# EAGLE schematic PCB-SSB-1x2b (EAGLE 6.4)
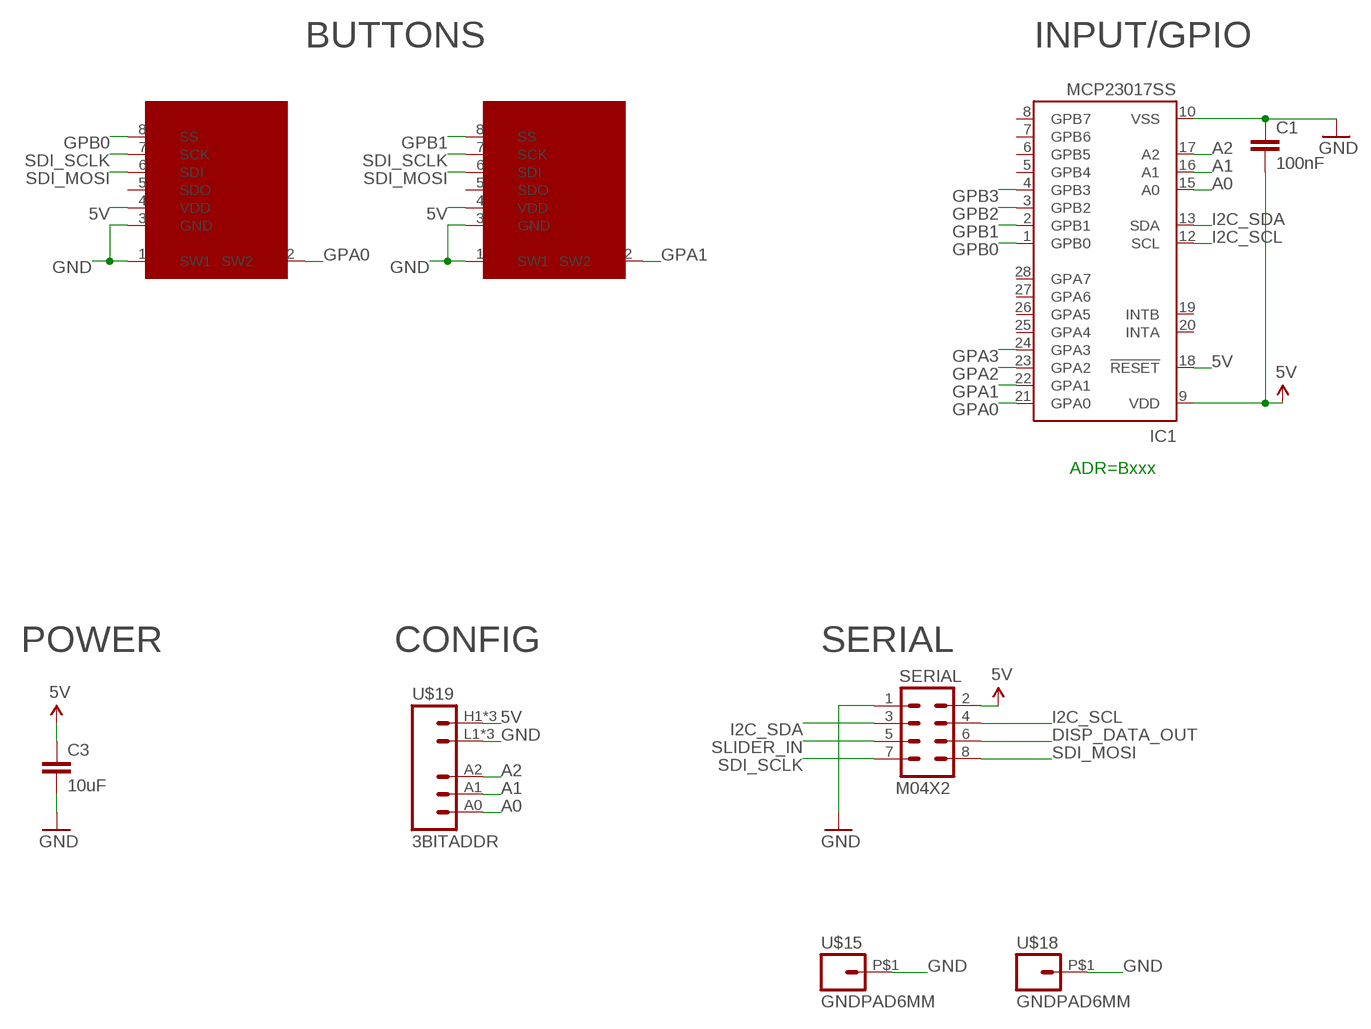
[diagram p0: schematic, sheet 1]

## Parts
C1  100nF  CAP0603-CAP  [0603-CAP]
C3  10uF  CAP0805  [0805]
IC1  MCP23017SS  [SSOP28]
SERIAL  M04X2  [2X4]
SSW1  SMART_SWITCHSMART_SWITCH_8PIN  [SMART_SWITCH]
SSW2  SMART_SWITCHSMART_SWITCH_8PIN  [SMART_SWITCH]
U$15  GNDPAD6MM  [3.2MMPAD6MM]
U$18  GNDPAD6MM  [3.2MMPAD6MM]
U$19  3BITADDR  [3BITADDR]

## Nets
5V [Power]: C1.2 C3.1 IC1.9(VDD) IC1.18(!RESET) SERIAL.2 SSW1.4(VDD) SSW2.4(VDD) U$19.H1(VCC) U$19.H2(VCC) U$19.H3(VCC)
A0: IC1.15(A0) U$19.A0
A1: IC1.16(A1) U$19.A1
A2: IC1.17(A2) U$19.A2
DISP_DATA_OUT: SERIAL.6
GND [Power]: C1.1 C3.2 IC1.10(VSS) SERIAL.1 SSW1.1(SW1) SSW1.3(GND) SSW2.1(SW1) SSW2.3(GND) U$15.P$1 U$18.P$1 U$19.L1(GND) U$19.L2(GND) U$19.L3(GND)
GPA0: IC1.21(GPA0) SSW1.2(SW2)
GPA1: IC1.22(GPA1) SSW2.2(SW2)
GPA2: IC1.23(GPA2)
GPA3: IC1.24(GPA3)
GPB0: IC1.1(GPB0) SSW1.8(SS)
GPB1: IC1.2(GPB1) SSW2.8(SS)
GPB2: IC1.3(GPB2)
GPB3: IC1.4(GPB3)
I2C_SCL: IC1.12(SCL) SERIAL.4
I2C_SDA: IC1.13(SDA) SERIAL.3
SDI_MOSI: SERIAL.8 SSW1.6(SDI) SSW2.6(SDI)
SDI_SCLK: SERIAL.7 SSW1.7(SCK) SSW2.7(SCK)
SLIDER_IN: SERIAL.5
Unconnected: IC1.5(GPB4) IC1.6(GPB5) IC1.7(GPB6) IC1.8(GPB7) IC1.19(INTB) IC1.20(INTA) IC1.25(GPA4) IC1.26(GPA5) IC1.27(GPA6) IC1.28(GPA7) SSW1.5(SDO) SSW2.5(SDO)

## Notes on the sheet
- BUTTONS | INPUT/GPIO
- ADR=Bxxx
- POWER | CONFIG | SERIAL

## Library data of the parts
C1 C3 = SparkFun:CAP: Capacitor Standard 0603 ceramic capacitor, and 0.1" leaded capacitor.
IC1 = microchip:MCP23017: http://ww1.microchip.com/downloads/en/DeviceDoc/21952a.pdf Source: http://ww1.microchip.com/downloads/en/DeviceDoc/21952a.pdf; MF: MICROCHIP; MPN: MCP23017-E/SS; OC_FARNELL: 1467674; OC_NEWARK: 31K2960
SERIAL = SparkFun:M04X2
SSW1 SSW2 = SKAARHOJ:SMART_SWITCH: SMARTSWITCH IS15DSBFP4RGB www.nkksmartswitch.com
U$15 U$18 = SKAARHOJ:GNDPAD
U$19 = SKAARHOJ:3BITADDR

## Net classes
0 default: width 0.203 mm, drill 0.406 mm, clearance 0.203 mm
1 Power: width 0.406 mm, drill 0.61 mm, clearance 0.203 mm